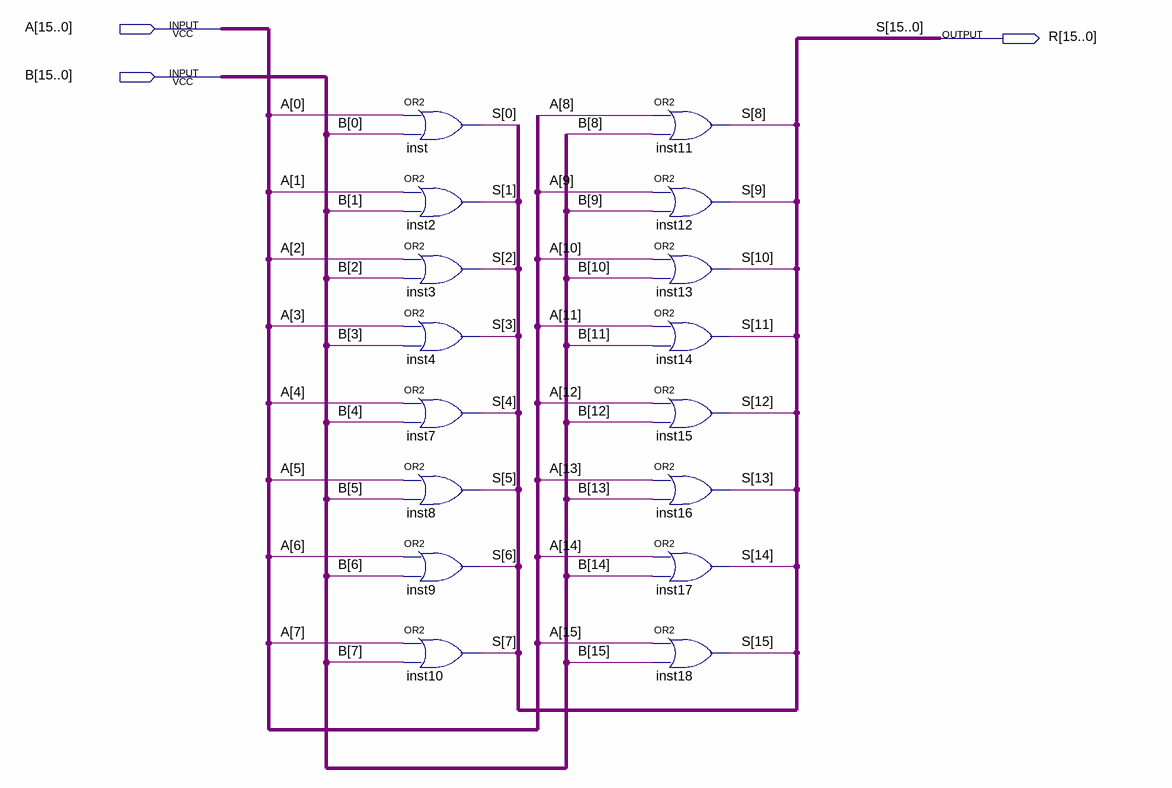
[diagram p0: schematic sheet]
// Quartus schematic OR16BIT.bdf as structural Verilog: 16 symbols, 3 pins
module OR16BIT (
  input  [15:0] A,
  input  [15:0] B,
  output [15:0] R
);

  or inst (R[0], A[0], B[0]);
  or inst2 (R[1], A[1], B[1]);
  or inst3 (R[2], A[2], B[2]);
  or inst4 (R[3], A[3], B[3]);
  or inst7 (R[4], A[4], B[4]);
  or inst8 (R[5], A[5], B[5]);
  or inst9 (R[6], A[6], B[6]);
  or inst10 (R[7], A[7], B[7]);
  or inst11 (R[8], A[8], B[8]);
  or inst12 (R[9], A[9], B[9]);
  or inst13 (R[10], A[10], B[10]);
  or inst14 (R[11], A[11], B[11]);
  or inst15 (R[12], A[12], B[12]);
  or inst16 (R[13], A[13], B[13]);
  or inst17 (R[14], A[14], B[14]);
  or inst18 (R[15], A[15], B[15]);

  // Other names for the same wires on the sheet: S[15:0] = R
endmodule
